# Altium schematic sheet MACH LOC NUOC KAROFI V3 271015.SchDoc
size A3
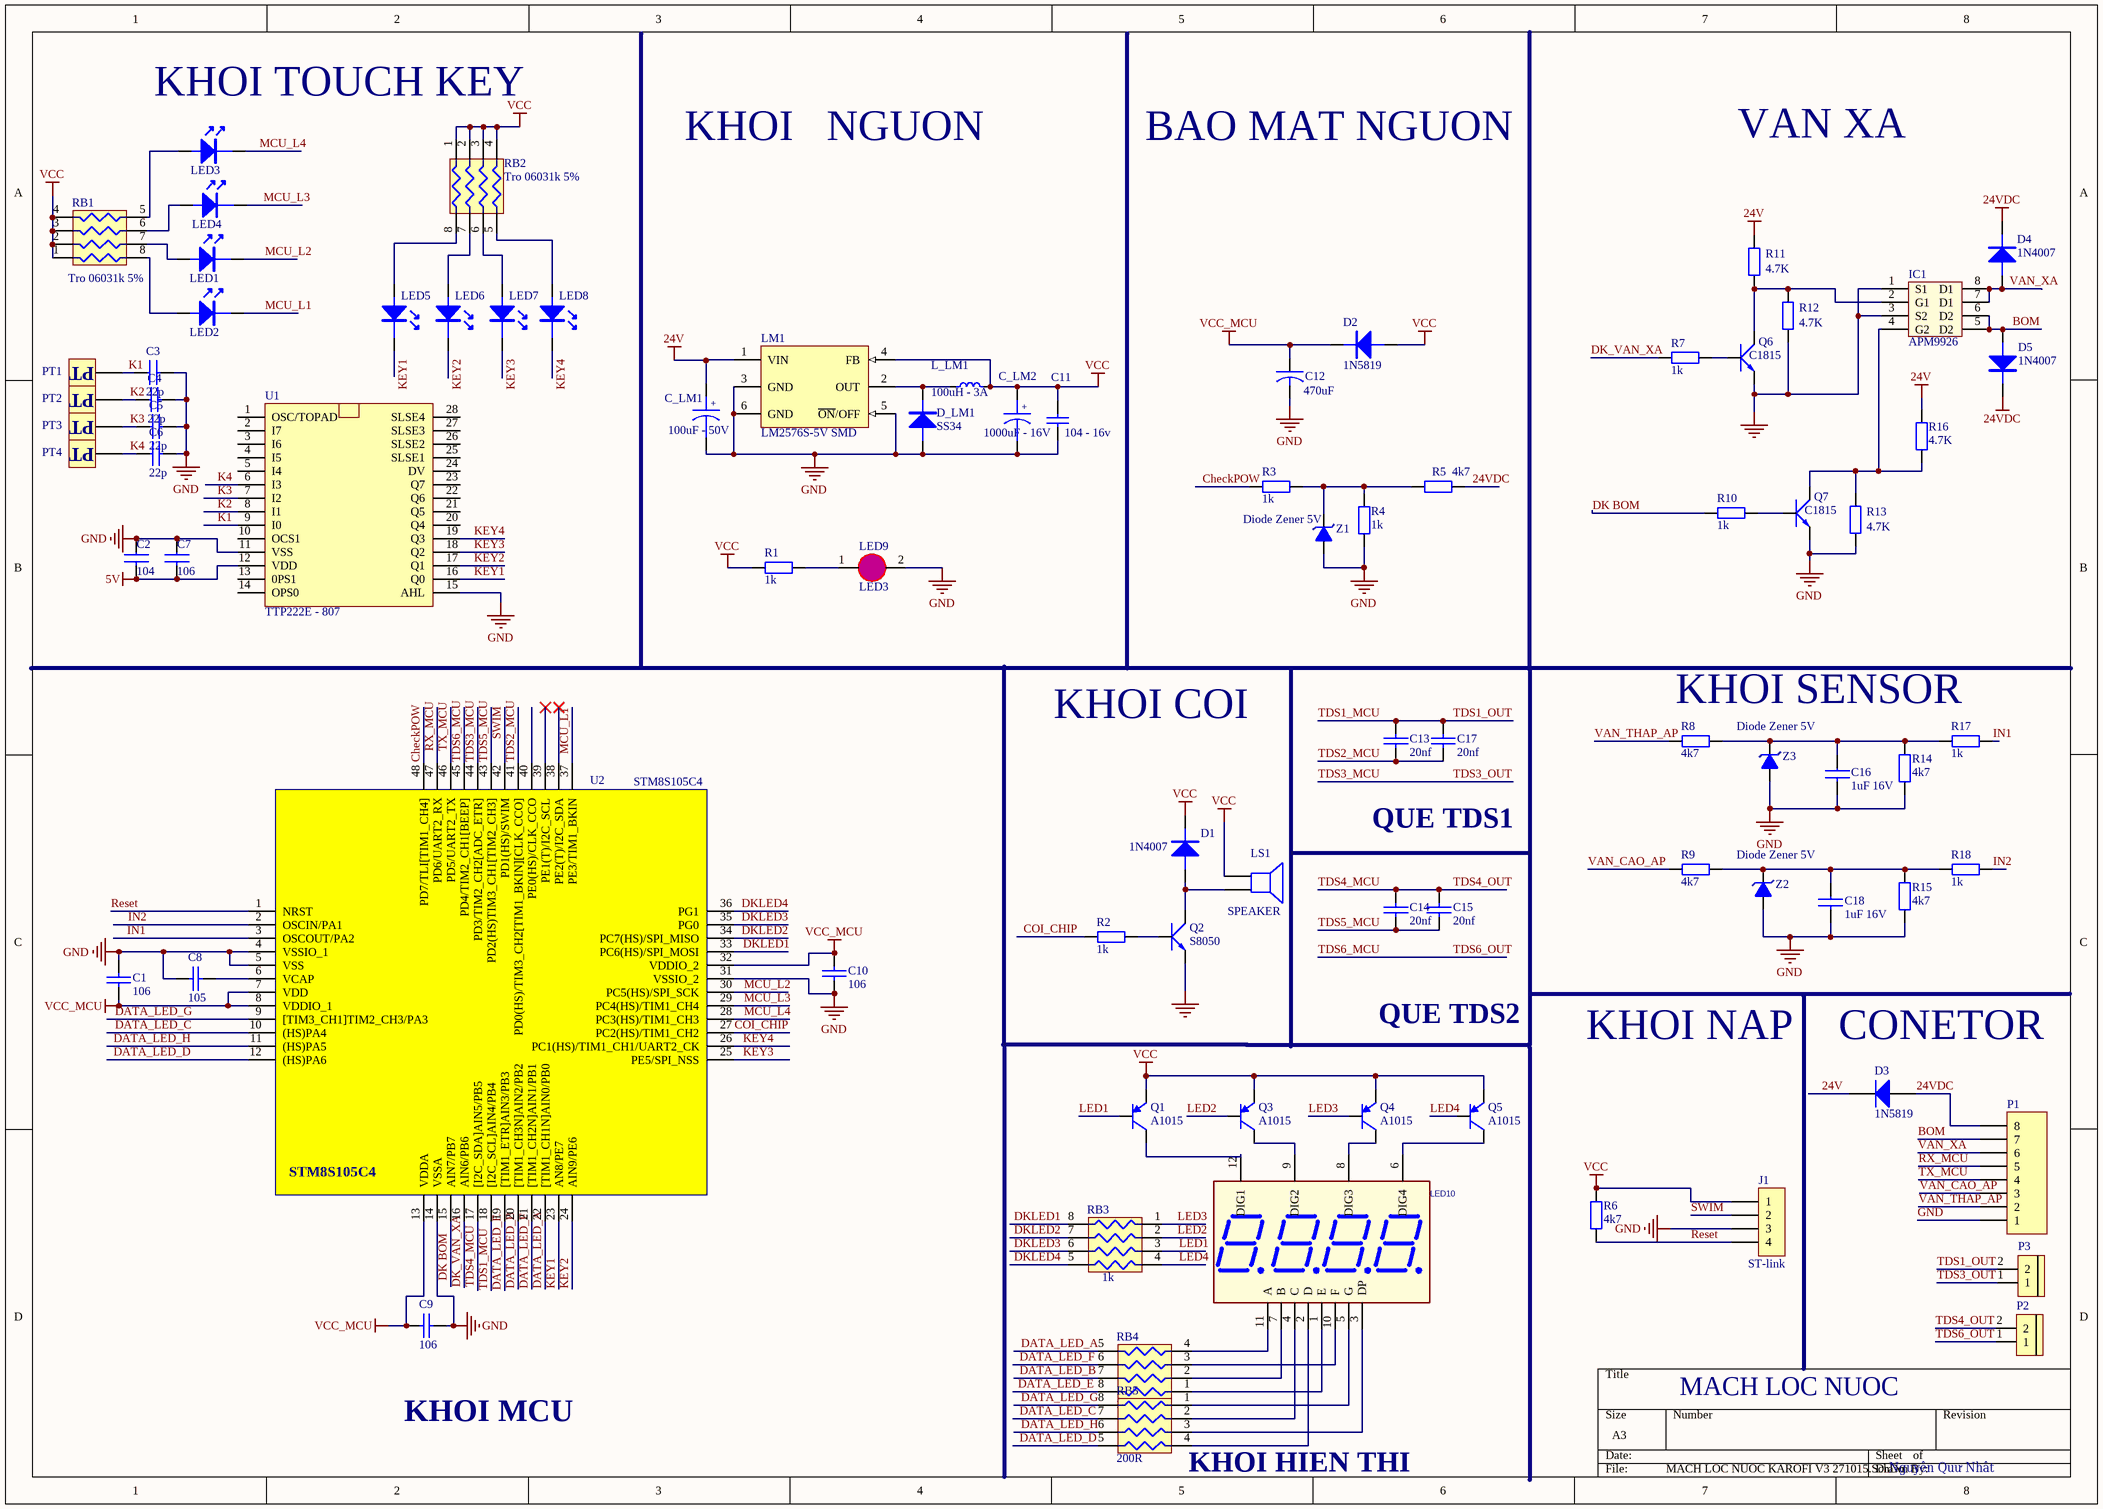
[diagram p0: MACH LOC NUOC KAROFI V3 271015.SchDoc]

## Parts
C1  106  [Tu 0805]
C2  Tu 0805 104  [Tu 0805]  (value not drawn)
C3  Tu 0805 22p  [Tu 0805]  (value not drawn)
C4  Tu 0805 22p  [Tu 0805]  (value not drawn)
C5  Tu 0805 22p  [Tu 0805]  (value not drawn)
C6  Tu 0805 22p  [Tu 0805]  (value not drawn)
C7  Tu 0805 106  [Tu 0805]  (value not drawn)
C8  105  [Tu 0805]
C9  106  [Tu 0805]
C10  106  [Tu 0805]
C11  Tu 0805 1100nF (104)  [Tu 0805]  (value not drawn)
C12  Tu Hoa 470uF - 16V  [CAP1000uF25V]  (value not drawn)
C13  20nf  [Tu 0805]
C14  20nf  [Tu 0805]
C15  20nf  [Tu can Tantan 5.08]
C16  1uF 16V  [Tu 0805]
C17  20nf  [Tu can Tantan 5.08]
C18  1uF 16V  [Tu 0805]
C_LM1  Tu Nhom100uF - 50V  [Tu Nhom 100uF -50V]  (value not drawn)
C_LM2  Tu Hoa 1000uF - 16V  [CAP 100uF-50V SMD]  (value not drawn)
D1  1N4007  [DO - SMB]
D2  1N5819  [DO - SMB]
D3  1N5819  [DO - SMB]
D4  1N4007  [DO - SMB]
D5  1N4007  [DO - SMB]
D_LM1  Diode 1N5822 (SS34)  [DO - SMB]  (value not drawn)
IC1  APM9926  [SO-8N]
J1  ST-link  [HDR1X4]
L_LM1  Cuon Cam 100uH 3A  [L100uH3A]  (value not drawn)
LED1  LED 0805 Do SMD  [LED0805_MH]  (value not drawn)
LED2  LED 0805 Do SMD  [LED0805_MH]  (value not drawn)
LED3  LED 0805 Do SMD  [LED0805_MH]  (value not drawn)
LED4  LED 0805 Do SMD  [LED0805_MH]  (value not drawn)
LED5  LED 0805 Do SMD  [LED0805_MH]  (value not drawn)
LED6  LED 0805 Do SMD  [LED0805_MH]  (value not drawn)
LED7  LED 0805 Do SMD  [LED0805_MH]  (value not drawn)
LED8  LED 0805 Do SMD  [LED0805_MH]  (value not drawn)
LED9  LED3  [LED0805_MH]
LED10  LED7SEG4DIGIT  [LED7seg4]  (value not drawn)
LM1  LM2576S-5V SMD  [TO263-5]
LS1  SPEAKER  [SPEAKER]
P1  Header 8  [Header 8P 2.54 Duc Cong]  (value not drawn)
P2  Header 2  [Header 2 Duc Cong 2.54]  (value not drawn)
P3  Header 2  [Header 2 Duc Cong 2.54]  (value not drawn)
PT1  PAD TOUCH  [PAD TOUCH]  (value not drawn)
PT2  PAD TOUCH  [PAD TOUCH]  (value not drawn)
PT3  PAD TOUCH  [PAD TOUCH]  (value not drawn)
PT4  PAD TOUCH  [PAD TOUCH]  (value not drawn)
Q1  A1015  [SOT23B]
Q2  S8050  [SOT23B]
Q3  A1015  [SOT23B]
Q4  A1015  [SOT23B]
Q5  A1015  [SOT23B]
Q6  C1815  [SOT23B]
Q7  C1815  [SOT23B]
R1  value 1k  [Tro SMD 0805]  (hidden comment: Tro 0805 1k)
R2  value 1k  [Tro SMD 0805]  (hidden comment: Tro 0805 1k)
R3  value 1k  [Tro SMD 0805]  (hidden comment: Tro 0805 1k)
R4  value 1k  [Tro SMD 0805]  (hidden comment: Tro 0805 4k7 5%)
R5  value 4k7  [Tro SMD 0805]  (hidden comment: Tro 0805 4k7 5%)
R6  value 4k7  [Tro SMD 0805]  (hidden comment: Tro 0805 4k7 5%)
R7  value 1k  [Tro SMD 0805]  (hidden comment: Tro 0805 1k)
R8  value 4k7  [Tro SMD 0805]  (hidden comment: Tro 0805 4k7 5%)
R9  value 4k7  [Tro SMD 0805]  (hidden comment: Tro 0805 4k7 5%)
R10  value 1k  [Tro SMD 0805]  (hidden comment: Tro 0805 1k)
R11  value 4.7K  [Tro SMD 0805]  (hidden comment: Tro 0805 4.7K)
R12  value 4.7K  [Tro SMD 0805]  (hidden comment: Tro 0805 4.7K)
R13  value 4.7K  [Tro SMD 0805]  (hidden comment: Tro 0805 4.7K)
R14  value 4k7  [Tro SMD 0805]  (hidden comment: Tro 0805 4k7 5%)
R15  value 4k7  [Tro SMD 0805]  (hidden comment: Tro 0805 4k7 5%)
R16  value 4.7K  [Tro SMD 0805]  (hidden comment: Tro 0805 4.7K)
R17  value 1k  [Tro SMD 0805]  (hidden comment: Tro 0805 1k)
R18  value 1k  [Tro SMD 0805]  (hidden comment: Tro 0805 1k)
RB1  Tro 06031k 5%  [Tro Bang 4 0603]
RB2  Tro 06031k 5%  [Tro Bang 4 0603]
RB3  Tro 06031k 5%  [Tro Bang 4 0603]  (value not drawn)
RB4  Tro 0603 200R 5%  [Tro Bang 4 0603]  (value not drawn)
RB5  Tro 0603 200R 5%  [Tro Bang 4 0603]  (value not drawn)
U1  TTP222E - 807  [TSSOP28]
U2  STM8S105C4  [48A_M]
Z1  Diode Zener 5V  [ZENNER SMD]
Z2  Diode Zener 5V  [ZENNER SMD]
Z3  Diode Zener 5V  [ZENNER SMD]

## Nets
5V: C2.2 C7.2 U1.12(VDD)
24V: C_LM1.1 D3.2(K) LM1.1(VIN) R11.1 R16.2
24VDC: D3.1(A) D4.2 D5.2 P1.8 R5.2
GND: C1.1 C2.1 C3.2 C4.2 C5.2 C6.2 C7.1 C8.1 C9.2 C10.2 C11.1 C12.2 C16.2 C18.2 C_LM1.2 C_LM2.2 D_LM1.1 IC1.1(S1) IC1.3(S2) J1.3 LED9.2(K) LM1.3(GND) LM1.5(~{ON}/OFF) LM1.6(GND) P1.1 Q2.3(E) Q6.3(E) Q7.3(E) R4.2 R12.2 R13.2 R14.2 R15.2 U1.11(VSS) U1.15(AHL) U2.4(VSSIO_1) U2.5(VSS) U2.14(VSSA) U2.31(VSSIO_2) Z1.1(A) Z2.1(A) Z3.1(A)
VCC: C11.2 C_LM2.1 D1.2 D2.1 J1.1 L_LM1.2 LM1.4(FB) LS1.1 Q1.3(E) Q3.3(E) Q4.3(E) Q5.3(E) R1.2 R6.1 RB1.1 RB1.2 RB1.3 RB1.4 RB2.1 RB2.2 RB2.3 RB2.4
VCC_MCU: C1.2 C9.1 C10.1 C12.1 D2.2 U2.7(VDD) U2.8(VDDIO_1) U2.13(VDDA) U2.32(VDDIO_2)
BOM: D5.1 IC1.5(D2) IC1.6(D2) P1.7
CheckPOW: R3.2 U2.48(PD7/TLI[TIM1_CH4])
COI_CHIP: R2.2 U2.27(PC2(HS)/TIM1_CH2)
DATA_LED_A: RB4.5 U2.22([TIM1_CH1N]AIN0/PB0)
DATA_LED_B: RB4.7 U2.20([TIM1_CH3N]AIN2/PB2)
DATA_LED_C: RB5.7 U2.10((HS)PA4)
DATA_LED_D: RB5.5 U2.12((HS)PA6)
DATA_LED_E: RB4.8 U2.19([TIM1_ETR]AIN3/PB3)
DATA_LED_F: RB4.6 U2.21([TIM1_CH2N]AIN1/PB1)
DATA_LED_G: RB5.8 U2.9([TIM3_CH1]TIM2_CH3/PA3)
DATA_LED_H: RB5.6 U2.11((HS)PA5)
DK BOM: R10.2 U2.15(AIN7/PB7)
DK_VAN_XA: R7.2 U2.16(AIN6/PB6)
DKLED1: RB3.8 U2.33(PC6(HS)/SPI_MOSI)
DKLED2: RB3.7 U2.34(PC7(HS)/SPI_MISO)
DKLED3: RB3.6 U2.35(PG0)
DKLED4: RB3.5 U2.36(PG1)
IN1: R17.1 U2.3(OSCOUT/PA2)
IN2: R18.1 U2.2(OSCIN/PA1)
K1: C3.1 PT1.1 U1.9(I0)
K2: C4.1 PT2.1 U1.8(I1)
K3: C5.1 PT3.1 U1.7(I2)
K4: C6.1 PT4.1 U1.6(I3)
KEY1: LED5.2 U1.16(Q0) U2.23(AN8/PE7)
KEY2: LED6.2 U1.17(Q1) U2.24(AIN9/PE6)
KEY3: LED7.2 U1.18(Q2) U2.25(PE5/SPI_NSS)
KEY4: LED8.2 U1.19(Q3) U2.26(PC1(HS)/TIM1_CH1/UART2_CK)
LED1: Q1.1(B) RB3.3
LED2: Q3.1(B) RB3.2
LED3: Q4.1(B) RB3.1
LED4: Q5.1(B) RB3.4
MCU_L1: LED2.2 U2.37(PE3/TIM1_BKIN)
MCU_L2: LED1.2 U2.30(PC5(HS)/SPI_SCK)
MCU_L3: LED4.2 U2.29(PC4(HS)/TIM1_CH4)
MCU_L4: LED3.2 U2.28(PC3(HS)/TIM1_CH3)
Reset: J1.4 R6.2 U2.1(NRST)
RX_MCU: P1.5 U2.47(PD6/UART2_RX)
SWIM: J1.2 U2.42(PD1(HS)/SWIM)
TDS1_MCU: C13.2 C17.2 P3.2 U2.18([I2C_SCL]AIN4/PB4)  [also labelled TDS1_OUT]
TDS2_MCU: C13.1 C17.1 U2.41(PD0(HS)/TIM3_CH2[TIM1_BKIN][CLK_CCO])
TDS3_MCU: P3.1 U2.44(PD3/TIM2_CH2[ADC_ETR])  [also labelled TDS3_OUT]
TDS4_MCU: C14.2 C15.2 P2.2 U2.17([I2C_SDA]AIN5/PB5)  [also labelled TDS4_OUT]
TDS5_MCU: C14.1 C15.1 U2.43(PD2(HS)TIM3_CH1[TIM2_CH3])
TDS6_MCU: P2.1 U2.45(PD4/TIM2_CH1[BEEP])  [also labelled TDS6_OUT]
TX_MCU: P1.4 U2.46(PD5/UART2_TX)
VAN_CAO_AP: P1.3 R9.1
VAN_THAP_AP: P1.2 R8.1
VAN_XA: D4.1 IC1.7(D1) IC1.8(D1) P1.6
NetC8_2: C8.2 U2.6(VCAP)
NetC16_1: C16.1 R8.2 R14.1 R17.2 Z3.2(K)
NetC18_1: C18.1 R9.2 R15.1 R18.2 Z2.2(K)
NetD1_1: D1.1 LS1.2 Q2.2(C)
NetD_LM1_2: D_LM1.2 L_LM1.1 LM1.2(OUT)
NetIC1_2: IC1.2(G1) Q6.2(C) R11.2 R12.1
NetIC1_4: IC1.4(G2) Q7.2(C) R13.1 R16.1
NetLED1_1: LED1.1 RB1.7
NetLED2_1: LED2.1 RB1.8
NetLED3_1: LED3.1 RB1.5
NetLED4_1: LED4.1 RB1.6
NetLED5_1: LED5.1 RB2.8
NetLED6_1: LED6.1 RB2.7
NetLED7_1: LED7.1 RB2.6
NetLED8_1: LED8.1 RB2.5
NetLED9_1: LED9.1(A) R1.1
NetLED10_1: LED10.1(E) RB4.1
NetLED10_2: LED10.2(D) RB5.4
NetLED10_3: LED10.3(DP) RB5.3
NetLED10_4: LED10.4(C) RB5.2
NetLED10_5: LED10.5(G) RB5.1
NetLED10_6: LED10.6(DIG4) Q5.2(C)
NetLED10_7: LED10.7(B) RB4.2
NetLED10_8: LED10.8(DIG3) Q4.2(C)
NetLED10_9: LED10.9(DIG2) Q3.2(C)
NetLED10_10: LED10.10(F) RB4.3
NetLED10_11: LED10.11(A) RB4.4
NetLED10_12: LED10.12(DIG1) Q1.2(C)
NetQ2_1: Q2.1(B) R2.1
NetQ6_1: Q6.1(B) R7.1
NetQ7_1: Q7.1(B) R10.1
NetR3_1: R3.1 R4.1 R5.1 Z1.2(K)

Not connected (* = marked no-connect by the designer): U1 1(OSC/TOPAD) 2(I7) 3(I6) 4(I5) 5(I4) 10(OCS1) 13(0PS1) 14(OPS0) 20(Q4) 21(Q5) 22(Q6) 23(Q7) 24(DV) 25(SLSE1) 26(SLSE2) 27(SLSE3) 28(SLSE4); U2 38(PE2(T)/I2C_SDA)* 39(PE1(T)/I2C_SCL)* 40(PE0(HS)/CLK_CCO)

## Notes on the sheet
- KHOI TOUCH KEY
- KHOI   NGUON
- BAO MAT NGUON
- VAN XA
- KHOI SENSOR
- KHOI COI
- QUE TDS1
- QUE TDS2
- KHOI NAP
- (near D3) CONETOR
- MACH LOC NUOC
- KHOI MCU
- (near RB5) KHOI HIEN THI
- Nguyên Quư Nhât
- (in symbol 0805 104 - 50V) 104 - 16v
- (in symbol CAP 0805) 22p; 104; 106
- (in symbol CAPACITOR) 470uF
- (in symbol Cuon Cam 100uH 3A) 100uH - 3A
- (in symbol DIODE) SS34
- (in symbol PAD TOUCH) PT
- (in symbol Tro Bang 0603) 1k; 200R
- (in symbol Tu Hoa) +; 100uF - 50V; 1000uF - 16V

## Library data of the parts
C1 C8-C10 C13-C15 C17 = CAP: Capacitor
C2-C7 C16 C18 = CAP 0805: Right: 20; Bottom: 10
C11 = 0805 104 - 50V: Capacitor (Semiconductor SIM Model); Value: 0.1uF; Published: 8-Jun-2000; LatestRevisionDate: 17-Jul-2002; LatestRevisionNote: Re-released for DXP Platform.; PackageReference: C1206; Publisher: Altium Limited
C12 = CAPACITOR
C_LM1 C_LM2 = Tu Hoa
D1 D2 D4 D5 D_LM1 = DIODE
D3 = Diode Dan 1N5819: Published: 8-Jun-2000; LatestRevisionDate: 17-Jul-2002; LatestRevisionNote: Re-released for DXP Platform.; DatasheetDocument: 1998; PackageDocument: Aug-1999; PackageReference: DO-201AD; Publisher: Altium Limited; ComponentLink1Description: Manufacturer Link; ComponentLink1URL: http://www.fairchildsemi.com/; ComponentLink2Description: Datasheet; ComponentLink2URL: http://www.fairchildsemi.com/ds/1N%2F1N5400.pdf
IC1 = APM4953: Dual P-Channel Enhancement Mode MOSFET
J1 = CON4: Connector
LED1-LED8 = LED
LED9 = LEDSMD: LED 3mm
LM1 = LM2576.xxV: PartNumber: LM2576T-5.0; Manufacturer: National Semiconductor; CompType: Switcher; PackageTopMarking: NSUZXYTT*LM2576T*-5.0 P+; PowerWise: N; FirstPublished: 4-Dec-2008; DatasheetVersion: Aug-2004; PackageVersion: revJ, Jan-1992; PackageReference: T05A; Publisher: Altium Limited; PackageDescription: TO-220, Molded, 5 Lead, Straight; RoHS: O; PinCount: 5; DigiKeyPartNumber: LM2576T-5.0-ND; Code_JEDEC: TO-220-AB; ComponentLink1Description: LM2576 Datasheet; ComponentLink1URL: http://www.national.com/ds/LM/LM2576.pdf; ComponentLink2Description: LM2576 Web Page; ComponentLink2URL: http://www.national.com/pf/LM/LM2576.html; ComponentLink3Description: T05A Package Page; ComponentLink3URL: http://www.national.com/packaging/folders/t05a.html
P1 = Header 8: Header, 8-Pin; LatestRevisionDate: 17-Jul-2002; LatestRevisionNote: Re-released for DXP Platform.; Publisher: Altium Limited
P2 P3 = Header 2: Big Header 2
Q1 Q3-Q5 = 2SA1015: PNP General Purpose Amplifier; Published: 8-Jun-2000; LatestRevisionDate: 15-Jan-2003; LatestRevisionNote: PCB Footprint 'BCY-W3/D4.7' replaced; DatasheetDocument: 1997; PackageReference: TO-92A; Publisher: Altium Limited; Code_JEDEC: TO-92A
Q2 = C1815: NPN 600mW, ECB; Value: C1815
Q6 Q7 = C1815: NPN 600mW, ECB; Value: C1815
R1-R18 = Tro 0805
RB1-RB5 = Tro Bang 0603
U1 = TTP222E
Z1-Z3 = Diode Zener: Diode  Zener